# Altium project Dualshock-3-type-C.PrjPcb
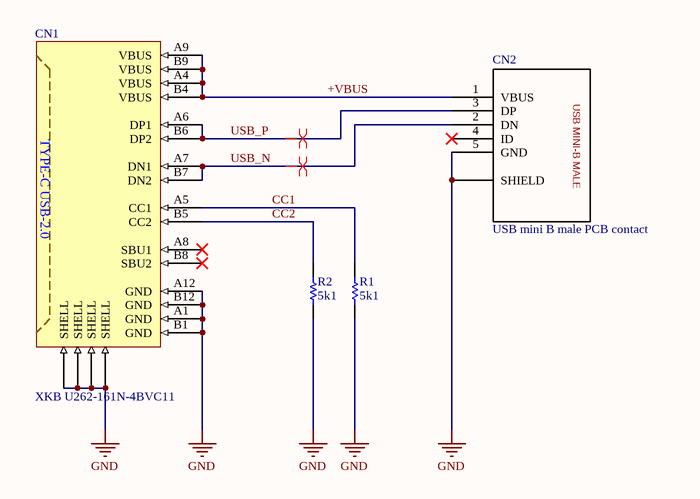
[diagram p0: Dualshock-3-type-C._schematic.SchDoc]
1 sheet, 4 parts. Net scope: global (net labels, ports and power ports of the same name join across sheets).
Board files: Dualshock-3-type-C_pcb.PcbDoc, PS3_CMOD_panel.PcbDoc, Dualshock-3-type-C_pcb_MOUSEBITE.PcbDoc, PS3_CMOD_panel_MOUSEBITE.PcbDoc

## Sheet Dualshock-3-type-C._schematic.SchDoc
size A4; SheetNumber: 1; SheetTotal: 1

### Parts
CN1  XKB U262-161N-4BVC11  [XKB U262-161N-4BVC11 - minimalPads]
CN2  USB mini B male PCB contact  [USB mini B male PCB contact]
R1  value 5k1  [RESC1005X40X25LL10T10]  (hidden comment: 0402WGF5101TCE)
R2  value 5k1  [RESC1005X40X25LL10T10]  (hidden comment: 0402WGF5101TCE)

### Nets
GND: CN1.A1(GND) CN1.A12(GND) CN1.B1(GND) CN1.B12(GND) CN1.SHELL1(SHELL) CN1.SHELL2(SHELL) CN1.SHELL3(SHELL) CN1.SHELL4(SHELL) CN2.5(GND) CN2.6(SHIELD) R1.1 R2.1
+VBUS: CN1.A4(VBUS) CN1.A9(VBUS) CN1.B4(VBUS) CN1.B9(VBUS) CN2.1(VBUS)
CC1: CN1.A5(CC1) R1.2
CC2: CN1.B5(CC2) R2.2
USB_N: CN1.A7(DN1) CN1.B7(DN2) CN2.2(DN)
USB_P: CN1.A6(DP1) CN1.B6(DP2) CN2.3(DP)

Not connected (* = marked no-connect by the designer): CN1 A8(SBU1)* B8(SBU2)*; CN2 4(ID)*

### Layout directives
differential pair: USB_N, USB_P

### Notes on the sheet
- (in symbol USB mini B male PCB contact) USB MINI-B MALE
- (in symbol XKB U262-161N-4BVC11) TYPE-C USB-2.0

### Library data of the parts
CN1 = XKB U262-161N-4BVC11: USB Type-C connector, USB-2.0, 16 pins; LCSC: C319148
R1 R2 = CMP-1011-00091-2: Manufacturer: UNI-ROYAL; Part Number: 0402WGF5101TCE; LCSC: C25905